# EAGLE design SOC_2_0 (EAGLE 8.3.2)
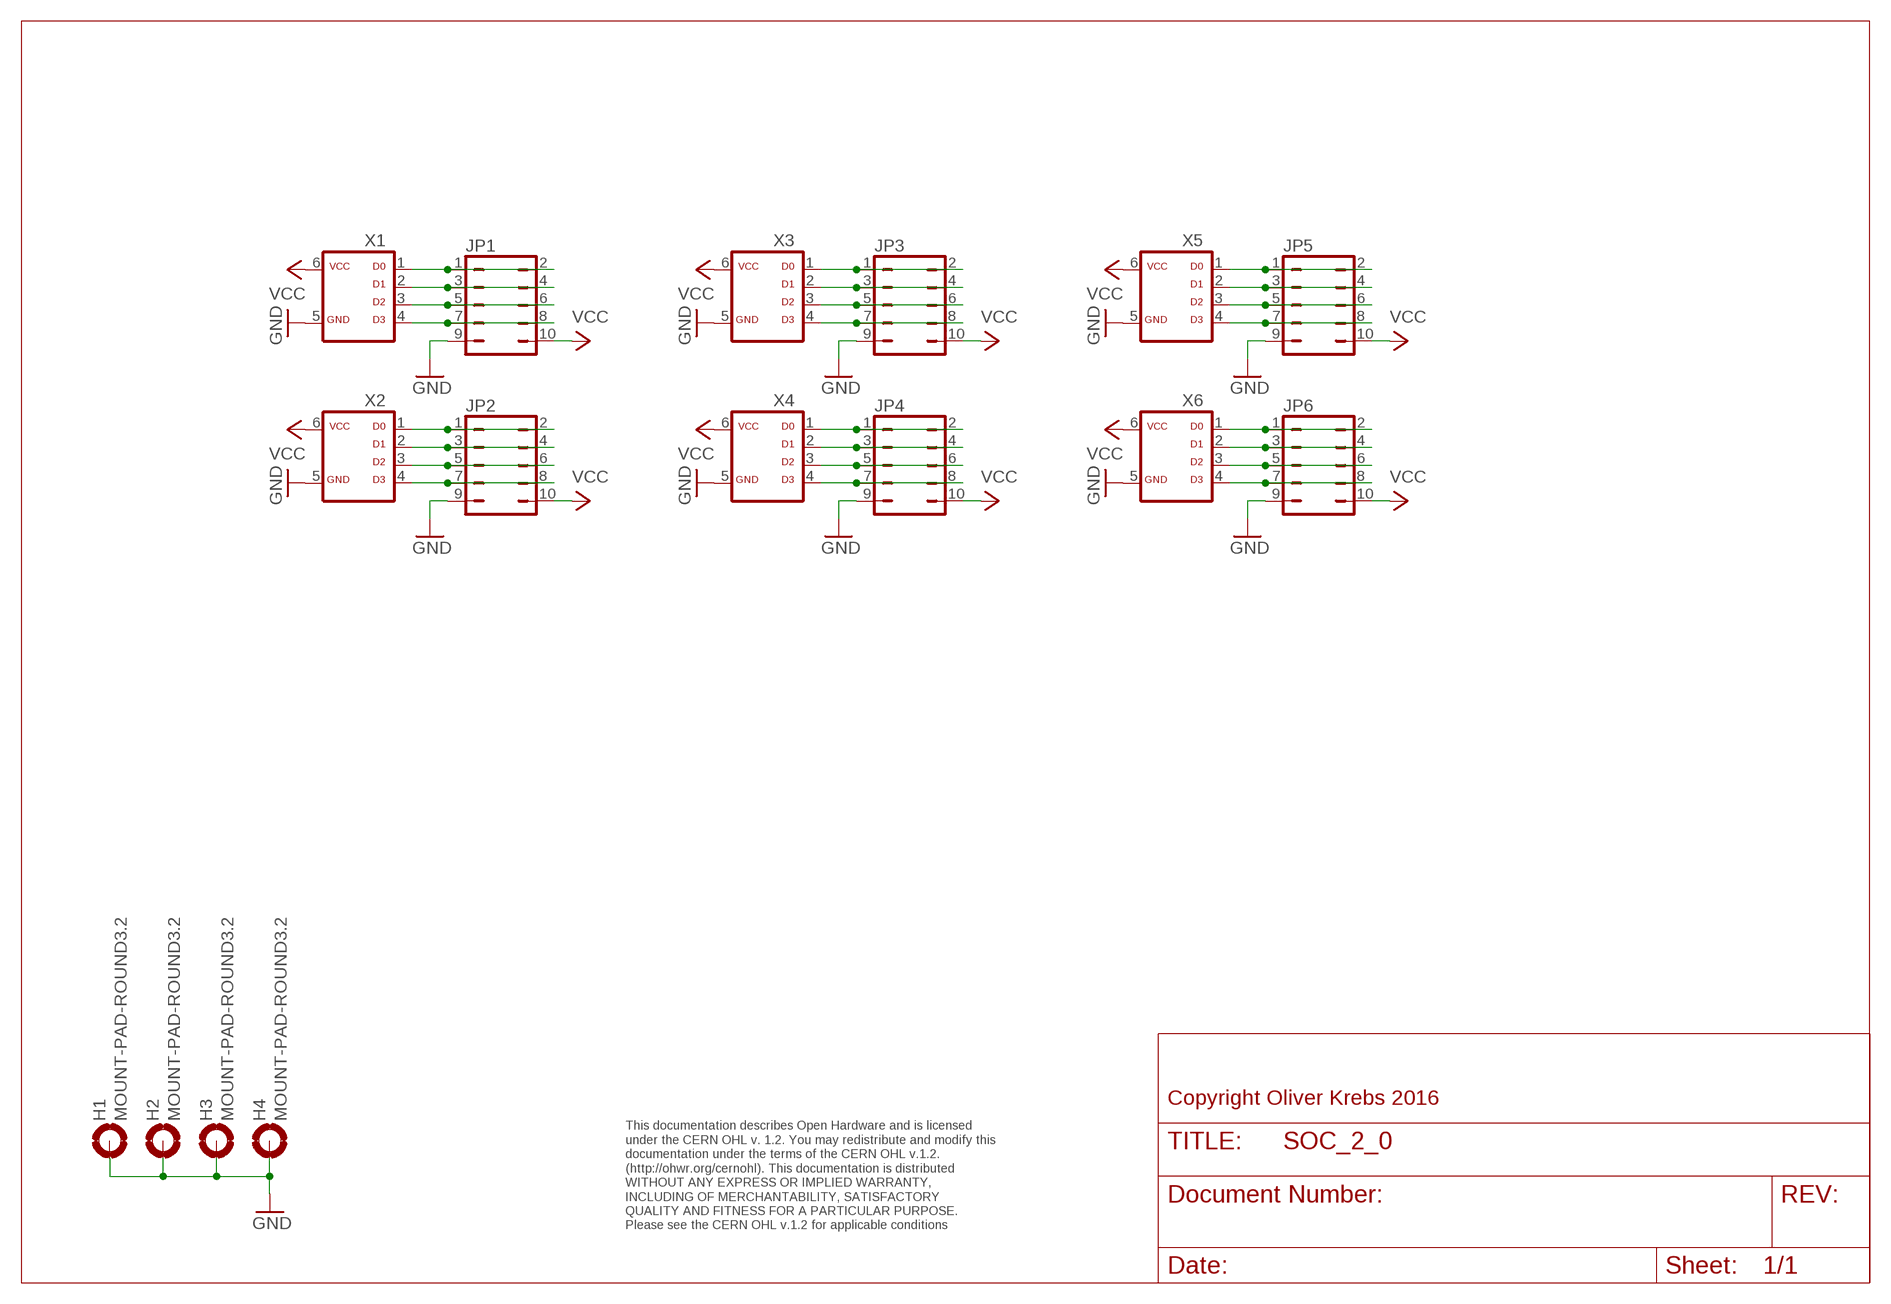
[diagram p0: schematic, sheet 1]

## Parts
H1  MOUNT-PAD-ROUND3.2  [3,2-PAD]
H2  MOUNT-PAD-ROUND3.2  [3,2-PAD]
H3  MOUNT-PAD-ROUND3.2  [3,2-PAD]
H4  MOUNT-PAD-ROUND3.2  [3,2-PAD]
JP1  JP5Q  [JP5Q]
JP2  JP5Q  [JP5Q]
JP3  JP5Q  [JP5Q]
JP4  JP5Q  [JP5Q]
JP5  JP5Q  [JP5Q]
JP6  JP5Q  [JP5Q]
X1  ML6D  [ML-6]
X2  ML6D  [ML-6]
X3  ML6D  [ML-6]
X4  ML6D  [ML-6]
X5  ML6D  [ML-6]
X6  ML6D  [ML-6]

## Nets
GND: H1.B3,2(MOUNT) H2.B3,2(MOUNT) H3.B3,2(MOUNT) H4.B3,2(MOUNT) JP1.9 JP2.9 JP3.9 JP4.9 JP5.9 JP6.9 X1.5 X2.5 X3.5 X4.5 X5.5 X6.5
N$1: JP1.1 JP1.2 X1.1
N$2: JP1.3 JP1.4 X1.2
N$3: JP1.5 JP1.6 X1.3
N$4: JP1.7 JP1.8 X1.4
N$5: JP2.1 JP2.2 X2.1
N$6: JP2.3 JP2.4 X2.2
N$7: JP2.5 JP2.6 X2.3
N$8: JP2.7 JP2.8 X2.4
N$9: JP3.1 JP3.2 X3.1
N$10: JP3.3 JP3.4 X3.2
N$11: JP3.5 JP3.6 X3.3
N$12: JP3.7 JP3.8 X3.4
N$13: JP4.1 JP4.2 X4.1
N$14: JP4.3 JP4.4 X4.2
N$15: JP4.5 JP4.6 X4.3
N$16: JP4.7 JP4.8 X4.4
N$17: JP5.1 JP5.2 X5.1
N$18: JP5.3 JP5.4 X5.2
N$19: JP5.5 JP5.6 X5.3
N$20: JP5.7 JP5.8 X5.4
N$21: JP6.1 JP6.2 X6.1
N$22: JP6.3 JP6.4 X6.2
N$23: JP6.5 JP6.6 X6.3
N$24: JP6.7 JP6.8 X6.4
VCC: JP1.10 JP2.10 JP3.10 JP4.10 JP5.10 JP6.10 X1.6 X2.6 X3.6 X4.6 X5.6 X6.6

## Notes on the sheet
- Copyright Oliver Krebs 2016
- This documentation describes Open Hardware and is licensed 
  under the CERN OHL v. 1.2. You may redistribute and modify this 
  documentation under the terms of the CERN OHL v.1.2. 
  (http://ohwr.org/cernohl). This documentation is distributed
  WITHOUT ANY EXPRESS OR IMPLIED WARRANTY, 
  INCLUDING OF MERCHANTABILITY, SATISFACTORY 
  QUALITY AND FITNESS FOR A PARTICULAR PURPOSE. 
  Please see the CERN OHL v.1.2 for applicable conditions

## Library data of the parts
H1-H4 = holes:MOUNT-PAD-ROUND: MOUNTING PAD, round
JP1-JP6 = 01-my-jumper:JP5Q: JUMPER
X1-X6 = 01-my-con:ML6D

## Board
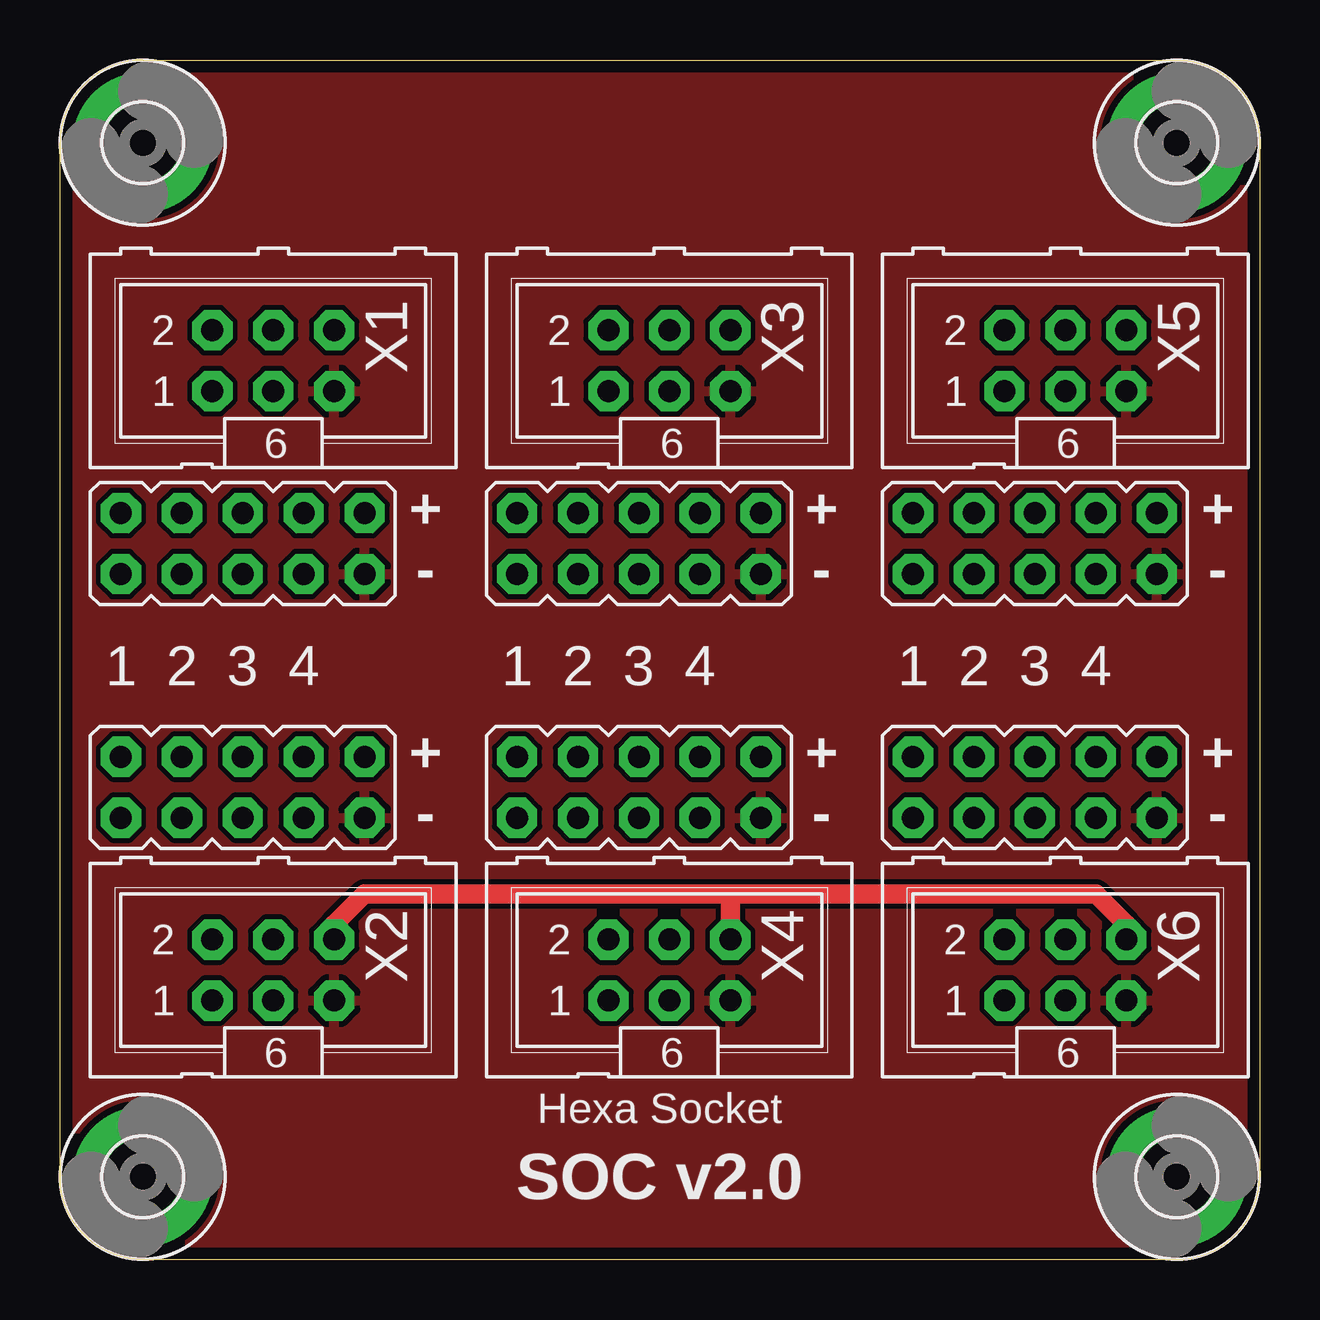
[diagram p1: board, top side]
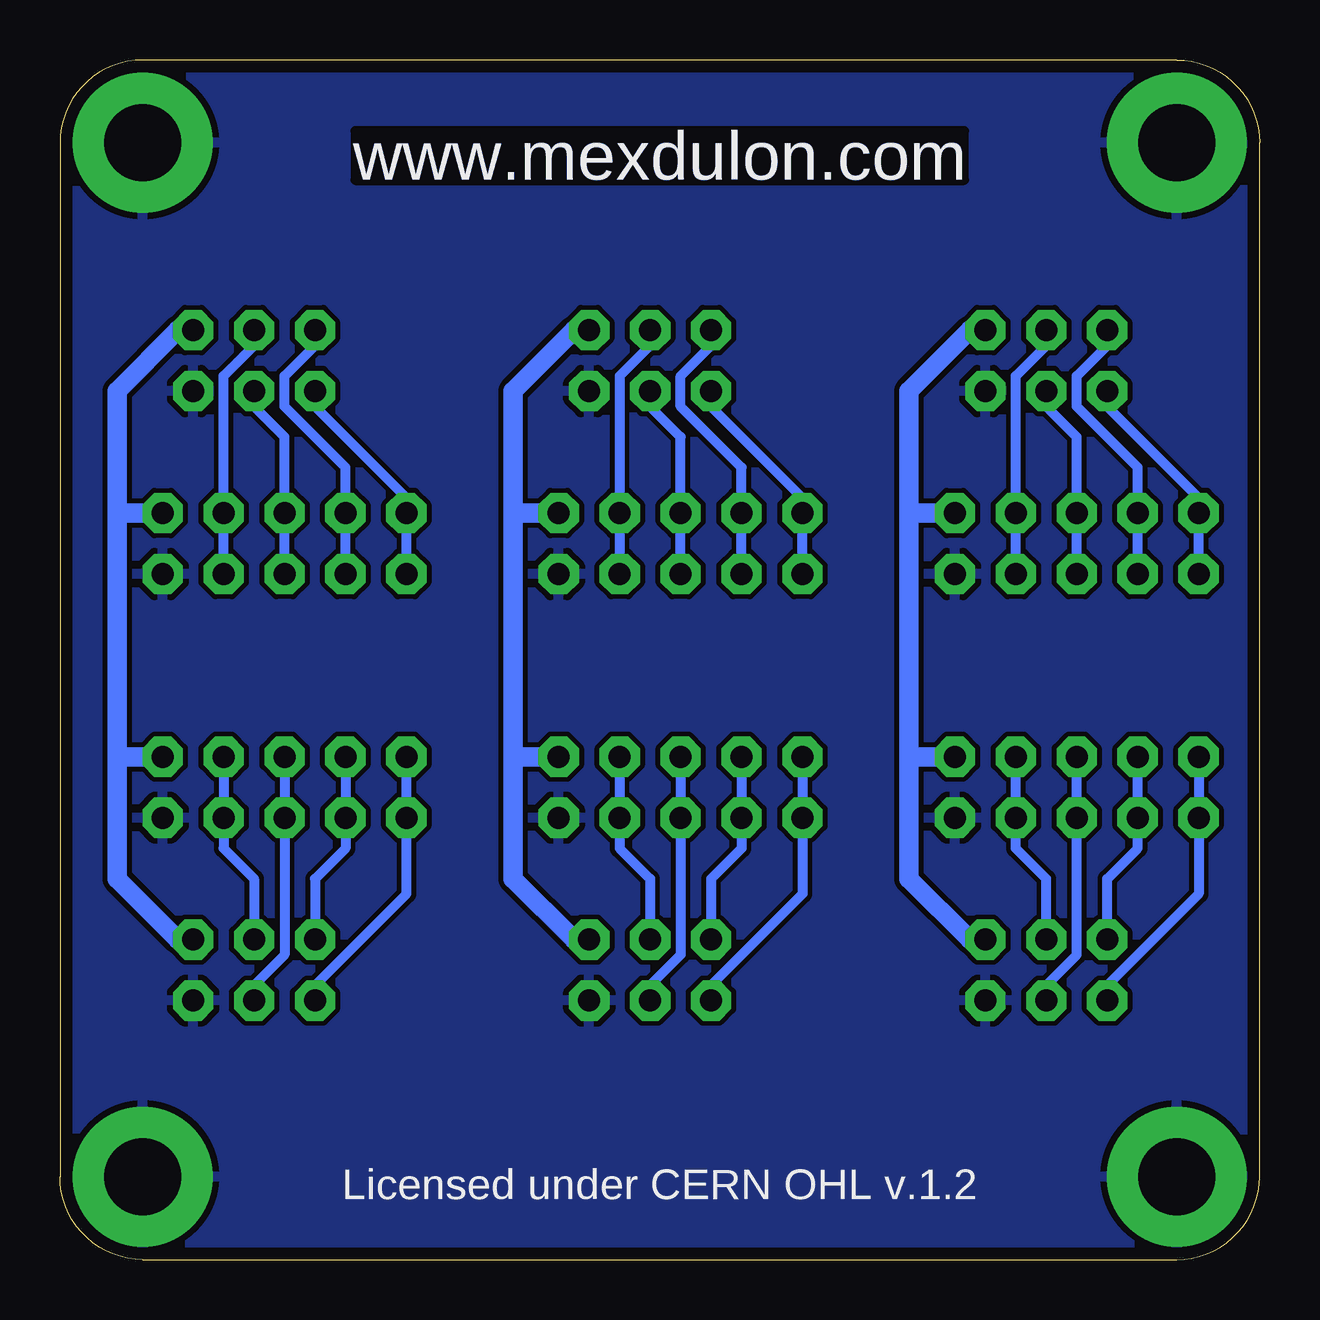
[diagram p2: board, bottom side, seen from below]

Size 50 x 50 mm. Coordinates in mm from the lower left corner, seen from the top.
Outline: 0,3.45 0,46.55 arc-90 3.45,50 46.55,50 arc-90 50,46.55 50,3.45 arc-90 46.55,0 3.45,0 arc-90 0,3.45
Copper layers (1*16): Top 0.035mm / dielectric 1.6mm / Bottom 0.035mm
Design rules "Elecrow_2-layer_PCB_eagle_rule_8mil": minimum track width 8mil, minimum drill 12mil, track to track 8mil, track to pad 8mil, pad to pad 8mil, via to via 8mil, smd to smd 0mil, copper to edge 20mil, drill to drill 10mil, minimum pad ring 6mil, minimum via ring 6mil, stop-mask expansion 0mil, vias tented up to drill 100mil, thermal gap 10mil

### Footprints (pad centres in the part's own frame; a part is rotated, then mirrored left to right if it is on the bottom)
3,2-PAD = drill 3.2 pad 5.842: B3,2 0,0
JP5Q = drill 0.914 pad 1.676 octagon: 1 -5.08,-1.27; 2 -5.08,1.27; 3 -2.54,-1.27; 4 -2.54,1.27; 5 0,-1.27; 6 0,1.27; 7 2.54,-1.27; 8 2.54,1.27; 9 5.08,-1.27; 10 5.08,1.27
ML-6 = drill 0.914 pad 1.676 octagon: 1 -2.54,-1.27; 2 -2.54,1.27; 3 0,-1.27; 4 0,1.27; 5 2.54,-1.27; 6 2.54,1.27

### Placement (x,y rotation side)
H1  3.45,3.45 0 top
H2  3.45,46.55 0 top
H3  46.55,3.45 0 top
H4  46.55,46.55 0 top
JP1  7.62,29.84 0 top
JP2  7.62,19.68 0 top
JP3  24.13,29.84 0 top
JP4  24.13,19.68 0 top
JP5  40.64,29.84 0 top
JP6  40.64,19.68 0 top
X1  8.89,37.47 0 top
X2  8.89,12.06 0 top
X3  25.4,37.47 0 top
X4  25.4,12.06 0 top
X5  41.91,37.47 0 top
X6  41.91,12.06 0 top

### Tracks (layer width: path | path; a pad name or v marks a point on that pad's centre or on a via)
GND
  pour Bottom: 0,0 50.8,0 50.8,50.8 0,50.8
  pour Top: 0,50.16 50.16,50.16 50.16,0 0,0
N$1
  Bottom 0.406: X1.1 6.35,35.56 2.54,31.75 JP1.2 JP1.1
N$2
  Bottom 0.406: JP1.3 JP1.4 5.08,33.02 7.62,35.56 7.62,36.83 6.35,38.1 X1.2
N$3
  Bottom 0.406: JP1.5 JP1.6 7.62,34.29 8.89,35.56 X1.3
N$4
  Bottom 0.406: X1.4 8.89,38.1 10.16,36.83 JP1.8 JP1.7
N$5
  Bottom 0.406: JP2.2 JP2.1 2.54,15.24 6.35,11.43 X2.1
N$6
  Bottom 0.406: JP2.4 JP2.3 5.08,17.14 6.35,15.88 X2.2
N$7
  Bottom 0.406: JP2.6 JP2.5 7.62,12.7 8.89,11.43 X2.3
N$8
  Bottom 0.406: JP2.8 JP2.7 10.16,17.14 8.89,15.88 X2.4
N$9
  Bottom 0.406: X3.1 22.86,35.56 19.05,31.75 JP3.2 JP3.1
N$10
  Bottom 0.406: JP3.3 JP3.4 21.59,33.02 24.13,35.56 24.13,36.83 22.86,38.1 X3.2
N$11
  Bottom 0.406: 24.13,31.75 JP3.6 | 24.13,31.75 24.13,34.29 25.4,35.56 X3.3 | JP3.5 24.13,31.75
N$12
  Bottom 0.406: X3.4 25.4,38.1 26.67,36.83 JP3.8 JP3.7
N$13
  Bottom 0.406: JP4.2 JP4.1 19.05,15.24 22.86,11.43 X4.1
N$14
  Bottom 0.406: JP4.4 JP4.3 21.59,17.14 22.86,15.88 X4.2
N$15
  Bottom 0.406: JP4.6 JP4.5 24.13,12.7 25.4,11.43 X4.3
N$16
  Bottom 0.406: JP4.8 JP4.7 26.67,17.14 25.4,15.88 X4.4
N$17
  Bottom 0.406: JP5.1 JP5.2 35.56,31.75 39.37,35.56 X5.1
N$18
  Bottom 0.406: X5.2 39.37,38.1 40.64,36.83 40.64,35.56 38.1,33.02 JP5.4 JP5.3
N$19
  Bottom 0.406: JP5.5 JP5.6 40.64,34.29 41.91,35.56 X5.3
N$20
  Bottom 0.406: X5.4 41.91,38.1 43.18,36.83 JP5.8 JP5.7
N$21
  Bottom 0.406: JP6.2 JP6.1 35.56,15.24 39.37,11.43 X6.1
N$22
  Bottom 0.406: JP6.4 JP6.3 38.1,17.14 39.37,15.88 X6.2
N$23
  Bottom 0.406: JP6.6 JP6.5 40.64,12.7 41.91,11.43 X6.3
N$24
  Bottom 0.406: JP6.8 JP6.7 43.18,17.14 41.91,15.88 X6.4
VCC
  Top 0.813: X2.6 11.43,13.97 12.7,15.24 27.94,15.24 | 27.94,15.24 43.18,15.24 44.45,13.97 X6.6 | X4.6 27.94,15.24
  Bottom 0.813: X2.6 12.06,13.34 14.61,15.88 14.61,20.95 | 14.61,20.95 14.61,31.11 | 14.61,31.11 14.61,36.2 12.06,38.73 X1.6 | JP1.10 14.61,31.11 | JP2.10 14.61,20.95 | X4.6 28.57,13.34 31.11,15.88 31.11,20.95 | 31.11,31.11 31.11,20.95 | 31.11,31.11 31.11,36.2 28.57,38.73 X3.6 | X5.6 45.09,38.73 47.62,36.2 47.62,31.11 | 47.62,31.11 47.62,20.95 | 47.62,20.95 47.62,15.88 45.09,13.34 X6.6 | JP6.10 47.62,20.95 | JP4.10 31.11,20.95 | JP3.10 31.11,31.11 | JP5.10 47.62,31.11

### Text on the board
Bottom: www.mexdulon.com
tPlace: + | + | + | - | - | - | 1 | 2 | 3 | 4 | 1 | 2 | 3 | 4 | 1 | 2 | 3 | 4 | + | + | + | - | - | -
tNames: Hexa Socket | SOC v2.0
bNames: www.mexdulon.com | Licensed under CERN OHL v.1.2